# EAGLE design expansion_can_rev_a (EAGLE 5.11)

## Sheet 1 of 2
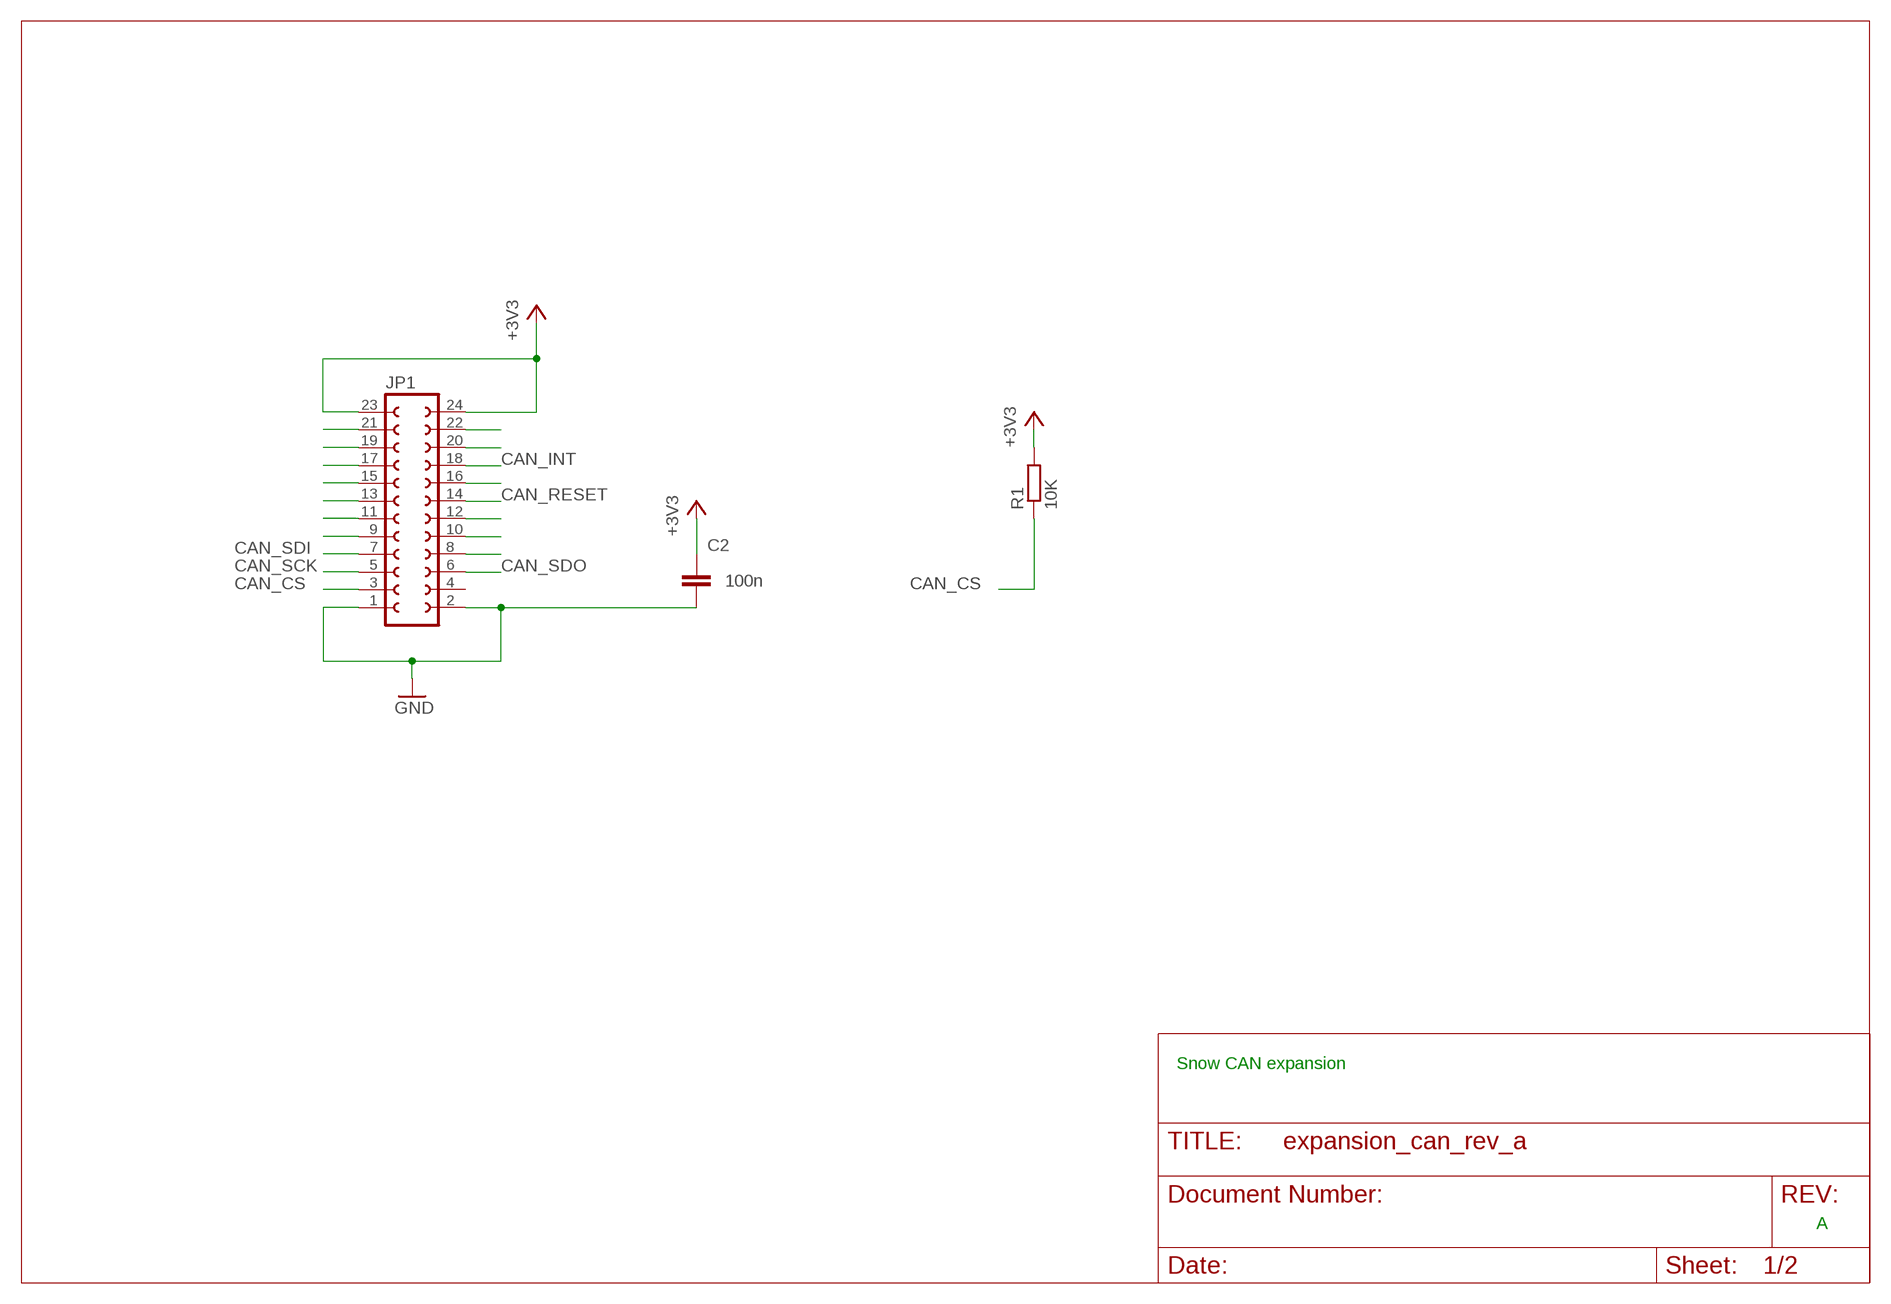
[diagram p0: schematic, sheet 1]

### Parts
C2  100n  C-EUC0805  [C0805]
JP1  FE12-2  [FE12-2]
R1  10K  R-EU_R0805  [R0805]

### Nets
+3V3: C2.1 JP1.23 JP1.24 R1.2 ; also sheet 2
CAN_CS: JP1.3 R1.1 ; also sheet 2
CAN_INT: JP1.18 ; also sheet 2
CAN_RESET: JP1.14 ; also sheet 2
CAN_SCK: JP1.5 ; also sheet 2
CAN_SDI: JP1.7 ; also sheet 2
CAN_SDO: JP1.6 ; also sheet 2
GND: C2.2 JP1.1 JP1.2 ; also sheet 2
N$9: JP1.22
N$10: JP1.20
N$12: JP1.16
N$14: JP1.12
N$15: JP1.10
N$16: JP1.8
N$21: JP1.21
N$22: JP1.19
N$23: JP1.17
N$24: JP1.15
N$25: JP1.13
N$26: JP1.11
N$27: JP1.9
Unconnected: JP1.4

### Notes on the sheet
- Snow CAN expansion
- A

## Sheet 2 of 2
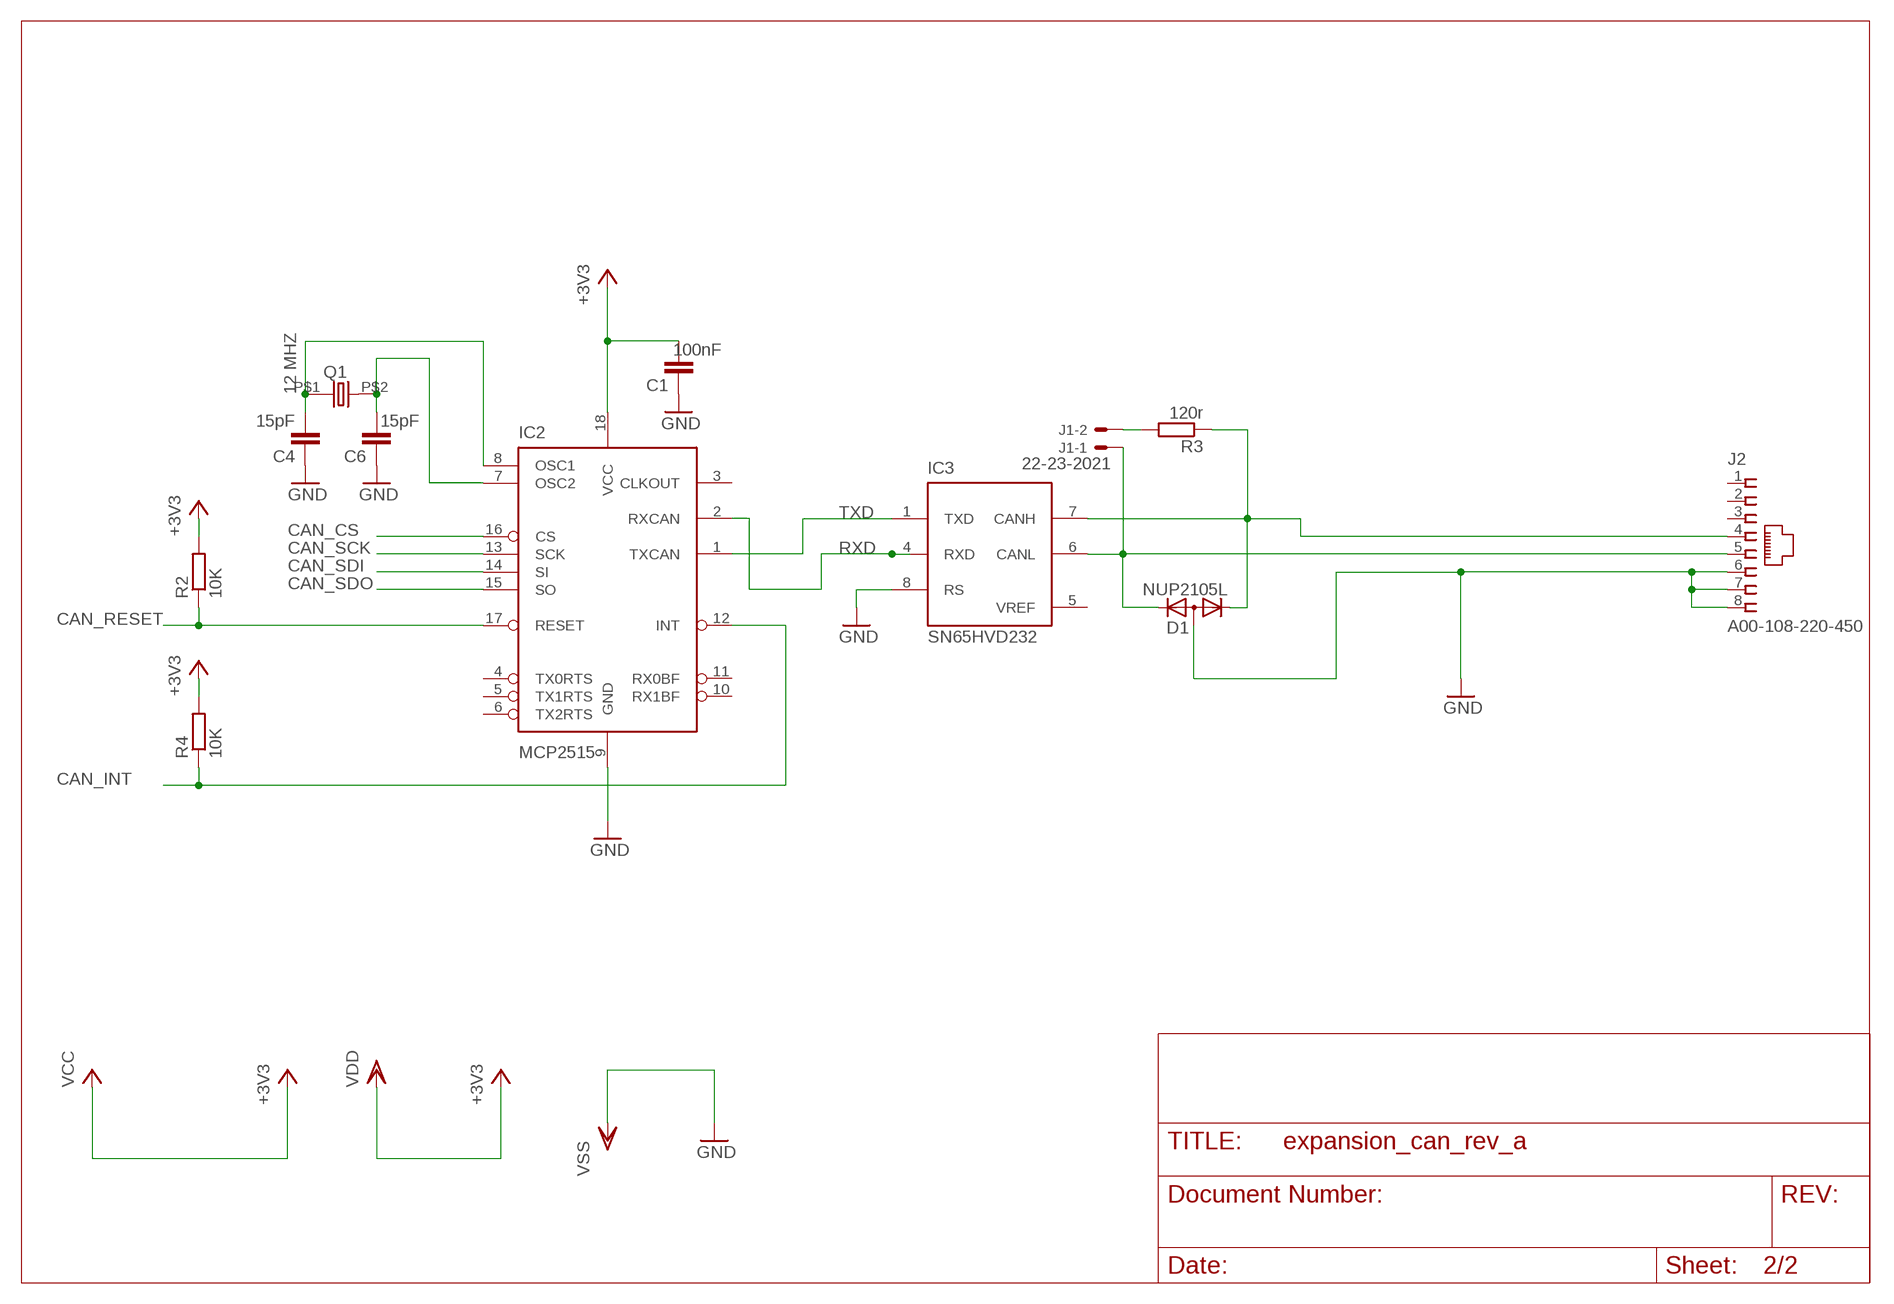
[diagram p1: schematic, sheet 2]

### Parts
C1  100nF  C-EUC0805  [C0805]
C4  15pF  C-EUC0805  [C0805]
C6  15pF  C-EUC0805  [C0805]
D1  NUP2105L  DIODE-2CA|ACSOT23  [SOT23]
IC2  MCP2515  [SO-18W]
IC3  SN65HVD232  MCP2551SN  [SO-08]
J1  22-23-2021  [22-23-2021]
J2  A00-108-220-450  [RJ-45]
Q1  12 MHZ  HC-49S  [9C]
R2  10K  R-EU_R0805  [R0805]
R3  120r  R-EU_R0805  [R0805]
R4  10K  R-EU_R0805  [R0805]

### Nets
+3V3: C1.2 IC2.18(VCC) R2.2 R4.2 ; supply symbol labelled VCC, VDD ; also sheet 1
CAN_CS: IC2.16(CS) ; also sheet 1
CAN_INT: IC2.12(INT) R4.1 ; also sheet 1
CAN_RESET: IC2.17(RESET) R2.1 ; also sheet 1
CAN_SCK: IC2.13(SCK) ; also sheet 1
CAN_SDI: IC2.14(SI) ; also sheet 1
CAN_SDO: IC2.15(SO) ; also sheet 1
CANH: D1.1(K1) IC3.7(CANH) J2.4 R3.1
CANL: D1.2(K2) IC3.6(CANL) J1.1 J2.5
GND: C1.1 C4.1 C6.1 D1.3(A) IC2.9(GND) IC3.8(RS) J2.6 J2.7 J2.8 ; supply symbol labelled VSS ; also sheet 1
N$1: J1.2 R3.2
N$2: C4.2 IC2.8(OSC1) Q1.P$1
N$7: C6.2 IC2.7(OSC2) Q1.P$2
RXD: IC2.2(RXCAN) IC3.4(RXD)
TXD: IC2.1(TXCAN) IC3.1(TXD)
Unconnected: IC2.3(CLKOUT) IC2.4(TX0RTS) IC2.5(TX1RTS) IC2.6(TX2RTS) IC2.10(RX1BF) IC2.11(RX0BF) J2.1 J2.2 J2.3

## Power pins joined to a net without a drawn wire
+3V3: IC3.3(VDD)
GND: IC3.2(VSS)
VREF: IC3.5(VREF)

## Library data of the parts
C1 C2 C4 C6 = rcl:C-EU: CAPACITOR, European symbol
D1 = diode:DIODE-2CA|AC: Dual DIODE Cathode-Anode|Anode-Cathode
IC2 = vscpcan:MCP2515
IC3 = microchip_can:MCP2551: High Speed CAN tranceiver
J1 = con-molex:22-23-2021: .100" (2.54mm) Center Header - 2 Pin; MF: MOLEX; MPN: 22-23-2021; OC_FARNELL: 1462926; OC_NEWARK: 25C3832
J2 = vscpcan:A00-108-220-450
JP1 = con-lsta:FE12-2: FEMALE HEADER; OC_FARNELL: unknown; OC_NEWARK: unknown
Q1 = vscpcan:HC-49S: Digikey 887-1050-1-nd
R1-R4 = rcl:R-EU_: RESISTOR, European symbol

## Board
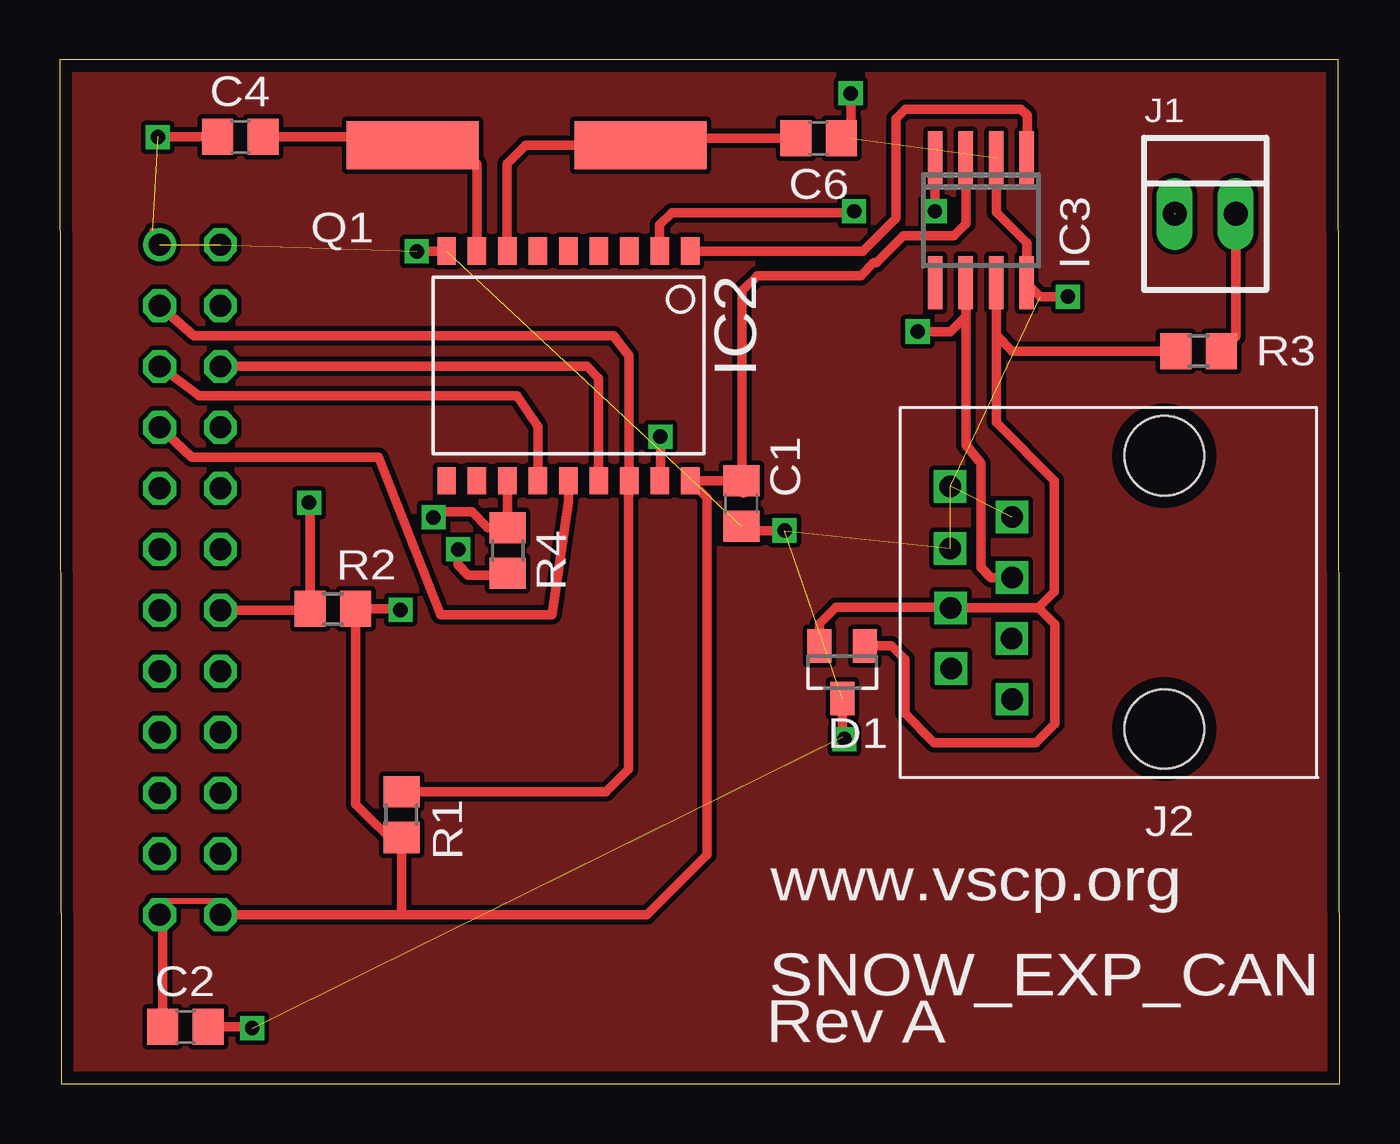
[diagram p2: board, top side]
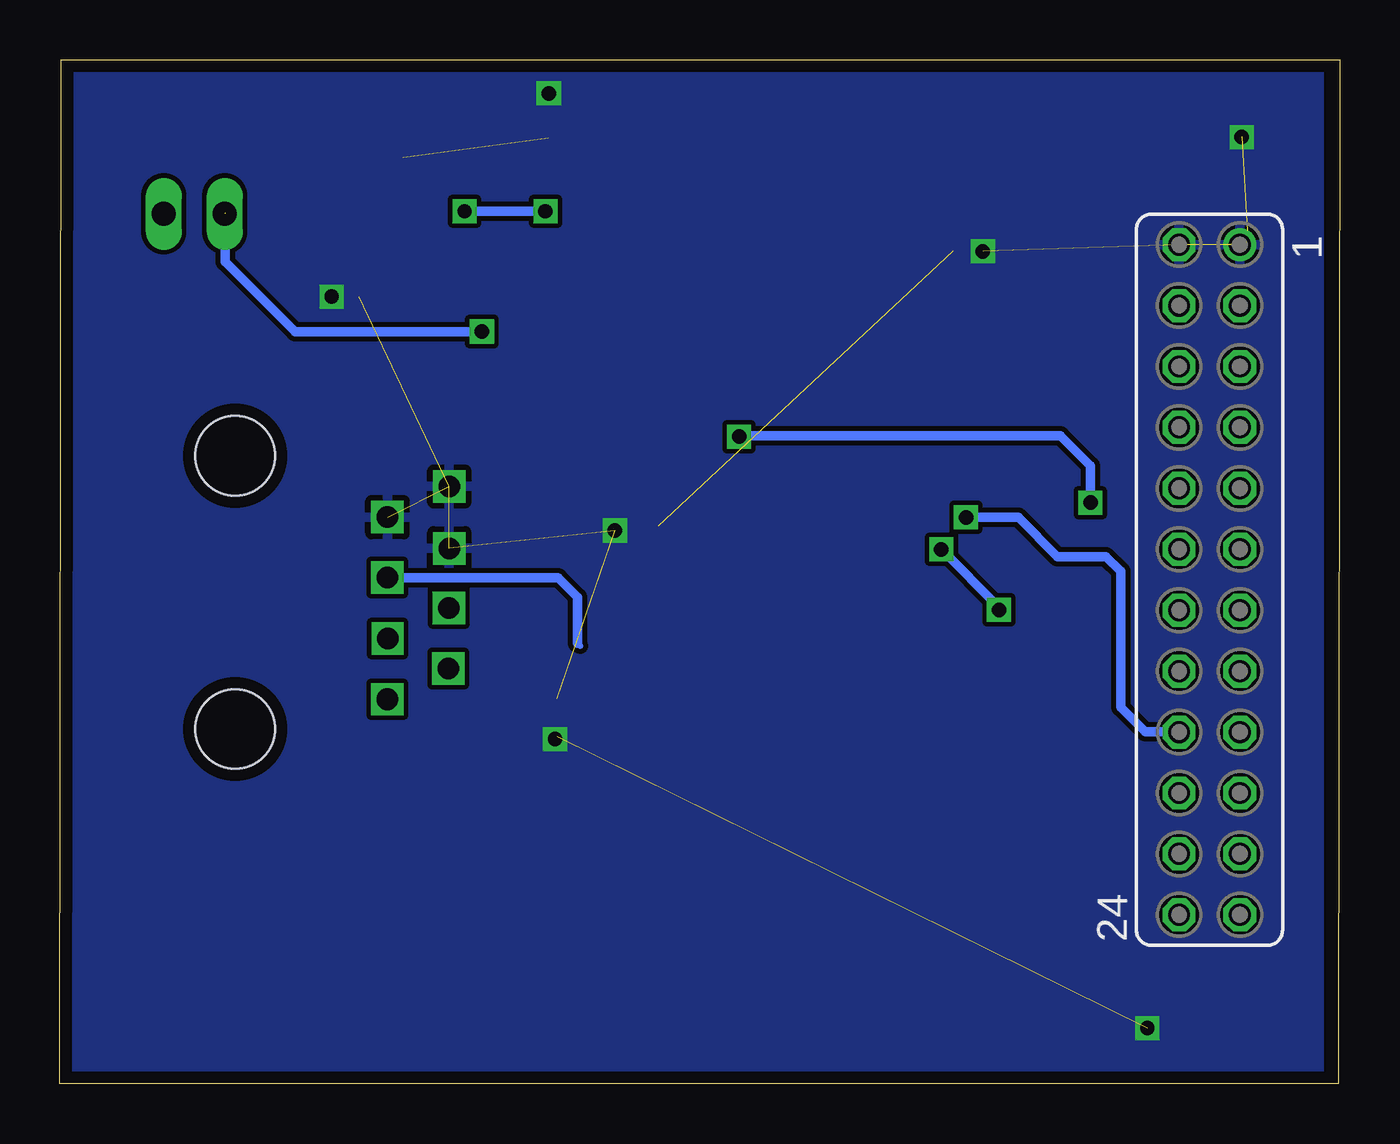
[diagram p3: board, bottom side, seen from below]

Size 53.36 x 42.68 mm. Coordinates in mm from the lower left corner, seen from the top.
Outline: 0.04,0 53.36,0 53.32,42.68 0,42.68 0.04,0
Copper layers (1*16): Top 0.035mm / dielectric 1.5mm / Bottom 0.035mm
Design rules "8mils": minimum track width 8mil, minimum drill 0.6mm, track to track 8mil, track to pad 8mil, pad to pad 8mil, via to via 8mil, smd to smd 0mil, copper to edge 20mil, drill to drill 10mil, minimum pad ring 8mil, minimum via ring 8mil, stop-mask expansion 0mil, vias tented up to drill 0mil, thermal gap 10mil

### Footprints (pad centres in the part's own frame; a part is rotated, then mirrored left to right if it is on the bottom)
C0805 = smd 1.3 x 1.5: 1 -0.95,0; 2 0.95,0
SOT23 = smd 1 x 1.4: 1 -0.95,-1.1; 2 0.95,-1.1; 3 0,1.1
SO-18W = smd 0.762 x 1.143: 1 -5.08,-4.788; 2 -3.81,-4.788; 3 -2.54,-4.788; 4 -1.27,-4.788; 5 0,-4.788; 6 1.27,-4.788; 7 2.54,-4.788; 8 3.81,-4.788; 9 5.08,-4.788; 10 5.08,4.788; 11 3.81,4.788; 12 2.54,4.788; 13 1.27,4.788; 14 0,4.788; 15 -1.27,4.788; 16 -2.54,4.788; 17 -3.81,4.788; 18 -5.08,4.788
SO-08 = smd 0.6 x 2.2: 1 -1.905,-2.6; 2 -0.635,-2.6; 3 0.635,-2.6; 4 1.905,-2.6; 5 1.905,2.6; 6 0.635,2.6; 7 -0.635,2.6; 8 -1.905,2.6
22-23-2021 = drill 1 long: 1 -1.27,0; 2 1.27,0
RJ-45 = drill 0.9 square: 1 -4.45,6.35; 2 -3.17,8.89; 3 -1.92,6.36; 4 -0.65,8.91; 5 0.62,6.35; 6 1.84,8.93; 7 3.14,6.35; 8 4.42,8.93 | hole 3.3: -5.7,0; 5.7,0
FE12-2 = drill 0.914 round: 1 -13.97,1.27 | drill 0.914 octagon: 2 -13.97,-1.27; 3 -11.43,1.27; 4 -11.43,-1.27; 5 -8.89,1.27; 6 -8.89,-1.27; 7 -6.35,1.27; 8 -6.35,-1.27; 9 -3.81,1.27; 10 -3.81,-1.27; 11 -1.27,1.27; 12 -1.27,-1.27; 13 1.27,1.27; 14 1.27,-1.27; 15 3.81,1.27; 16 3.81,-1.27; 17 6.35,1.27; 18 6.35,-1.27; 19 8.89,1.27; 20 8.89,-1.27; 21 11.43,1.27; 22 11.43,-1.27; 23 13.97,1.27; 24 13.97,-1.27
9C = smd 5.5 x 2: P$1 -4.74,0; P$2 4.76,0
R0805 = smd 1.3 x 1.5: 1 -0.95,0; 2 0.95,0

### Placement (x,y rotation side)
C1  28.41,24.19 90 top
C2  5.23,2.36 0 top
C4  7.52,39.47 0 top
C6  31.65,39.41 180 top
D1  32.62,17.15 180 top
IC2  21.2,29.92 180 top
IC3  38.41,35.99 180 top
J1  47.76,36.26 0 top
J2  46.06,20.48 90 top
JP1  5.42,21.01 270 bottom
Q1  19.45,39.12 0 top
R1  14.25,11.21 270 top
R2  11.39,19.79 0 top
R3  47.49,30.53 0 top
R4  18.68,22.23 270 top

### Tracks (layer width: path | path; a pad name or v marks a point on that pad's centre or on a via)
+3V3  (via drill 0.6)
  Top 0.254: JP1.24 6.39,7.62 3.85,7.62 JP1.23
  Top 0.406: JP1.23 4.28,7.04 C2.1 | JP1.24 14.32,7.04 | 14.32,7.04 24.48,7.04 26.99,9.55 26.99,24.43 IC2.18 C1.2 28.5,25.05 28.5,24.61 28.45,24.66 28.45,33.04 29.09,33.69 33.4,33.69 33.93,34.22 34.04,34.22 35.18,35.35 37.27,35.35 37.77,35.85 IC3.3 | 14.25,9.74 14.25,7.11 14.32,7.04 | 14.25,9.74 R1.2 | 14.25,9.74 12.34,11.65 R2.2 14.17,19.79 v14.2,19.75 | v16.61,22.27 16.61,21.62 17.03,21.2 18.6,21.2 R4.2
  Bottom 0.406: v14.2,19.75 14.2,19.87 v16.61,22.27
CAN_CS
  Top 0.406: JP1.3 5.59,31.17 23.08,31.17 23.74,30.34 IC2.16 23.71,25.1 23.71,13.1 22.77,12.16 R1.1
CAN_INT  (via drill 0.6)
  Top 0.406: IC2.12 18.66,23.19 R4.1 17.84,23.18 17.18,23.84 15.81,23.84 v15.58,23.61
  Bottom 0.406: v15.58,23.61 13.4,23.61 11.76,21.97 9.74,21.97 9.13,21.36 9.13,15.7 8.1,14.67 6.71,14.67 JP1.18
CAN_RESET  (via drill 0.6)
  Top 0.406: JP1.14 10.39,19.74 R2.1 10.44,24.17 v10.39,24.22 | v25.04,26.97 25.04,25.17 IC2.17
  Bottom 0.406: v10.39,24.22 10.39,25.75 11.65,27.01 25,27.01 v25.04,26.97
CAN_SCK
  Top 0.406: IC2.13 19.93,27.38 19.06,28.67 5.8,28.67 JP1.5
CAN_SDI
  Top 0.406: IC2.14 21.2,24.28 20.51,19.54 15.87,19.54 13.29,26.11 5.48,26.11 JP1.7
CAN_SDO
  Top 0.406: IC2.15 22.47,29.41 21.98,29.9 JP1.6
CANH
  Top 0.254: 37.17,19.85 J2.4
  Top 0.406: 39.04,31.21 39.04,27.56 41.47,25.13 41.47,20.52 40.8,19.85 | 39.04,31.21 IC3.7 | R3.1 39.72,30.53 39.04,31.21 | D1.1 34.67,18.25 35.23,17.69 35.23,15.43 36.46,14.21 40.69,14.21 41.49,15.01 41.49,19.15 40.8,19.85 | 40.8,19.85 37.17,19.85
CANL  (via drill 0.6)  (2 unrouted)
  Top 0.406: 37.77,32 37.77,26.63 38.41,25.87 38.41,21.52 38.83,21.1 J2.5 | 37.77,32 IC3.6 | D1.2 31.67,19.17 32.37,19.86 37.11,19.86 | v35.77,31.35 37.13,31.35 37.77,32
  Bottom 0.254: 31.78,18.36 D1.2
  Bottom 0.406: 46.47,36.28 46.47,34.26 43.56,31.35 v35.77,31.35 | J2.5 32.59,21.1 31.78,20.29 31.78,18.36
GND  (via drill 0.6)  (11 unrouted)
  Top 0.254: JP1.1 3.85,35.56
  Top 0.406: C4.1 v4.08,39.47 v4.08,39.46 | C6.1 32.98,39.41 v32.98,41.28 | v42.03,32.81 40.9,32.81 IC3.8 40.32,35.06 39.04,36.33 IC3.2 | D1.3 32.62,14.46 v32.72,14.36 | C2.2 7.96,2.36 v8.01,2.31 | v14.88,34.7 16.11,34.7 IC2.9 | v30.22,23.06 28.59,23.06 C1.1
  pour Bottom: 0.52,42.32 0.84,42.32 0.84,0.4 53.33,0.4 53.33,0.56 54.28,0.56 54.28,42.71 -5.66,42.71 -5.66,42.47
N$1
  Top 0.406: J1.2 49.03,31.13 R3.2
N$2
  Top 0.406: C4.2 14.71,39.47 Q1.P$1 14.74,39.15 16.57,39.15 17.39,38.33 IC2.8
N$3
  pour Top: 0.19,43.09 0.4,0.28 0.85,0.21 52.2,0.18 53.04,0.33 53.13,41.39 53.11,42.41
N$7
  Top 0.406: C6.2 24.21,39.41 Q1.P$2 19.41,39.12 18.64,38.35 18.64,34.73 IC2.7
RXD  (via drill 0.6)
  Top 0.406: IC2.2 25.01,35.8 25.52,36.3 33.05,36.3 v33.12,36.37 | v36.49,36.37 36.49,38.58 IC3.4
  Bottom 0.406: v33.12,36.37 v36.49,36.37
TXD
  Top 0.406: IC2.1 33.49,34.71 34.85,36.07 34.85,40.23 35.25,40.63 40.07,40.63 40.34,40.36 40.34,38.62 IC3.1

### Text on the board
tNames: www.vscp.org | SNOW_EXP_CAN | Rev A